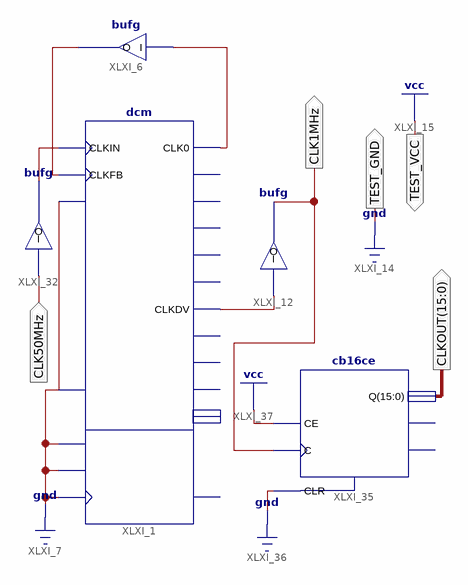
[diagram p0: schematic sheet 1]
// Xilinx ISE schematic hello_clock.sch (spartan3) as structural Verilog: 5 symbols, 5 ports
module hello_clock (
  input  CLK50MHz,
  output CLK1MHz,
  output [15:0] CLKOUT,
  output TEST_VCC,
  output TEST_GND
);

  wire XLXN_29, XLXN_66, XLXN_67, XLXN_69;

  dcm #(.CLKDV_DIVIDE(16), .CLKIN_DIVIDE_BY_2("FALSE"), .CLKFX_DIVIDE(32), .CLKFX_MULTIPLY(2)) XLXI_1 (
    .CLKFB(XLXN_29), .CLKIN(XLXN_67), .DSSEN(1'b0), .PSCLK(1'b0), .PSEN(1'b0), .PSINCDEC(1'b0), .RST(1'b0),
    .CLK0(XLXN_66), .CLKDV(XLXN_69));  // open: CLK180, CLK270, CLK2X, CLK2X180, CLK90, CLKFX, CLKFX180, LOCKED, PSDONE, STATUS
  bufg XLXI_6 (.I(XLXN_66), .O(XLXN_29));
  bufg XLXI_12 (.I(XLXN_69), .O(CLK1MHz));
  bufg XLXI_32 (.I(CLK50MHz), .O(XLXN_67));
  cb16ce XLXI_35 (.C(CLK1MHz), .CE(1'b1), .CLR(1'b0), .Q(CLKOUT));  // open: CEO, TC

  assign TEST_GND = 1'b0;
  assign TEST_VCC = 1'b1;
endmodule
